# EAGLE design svf4 (EAGLE 7.2.0)
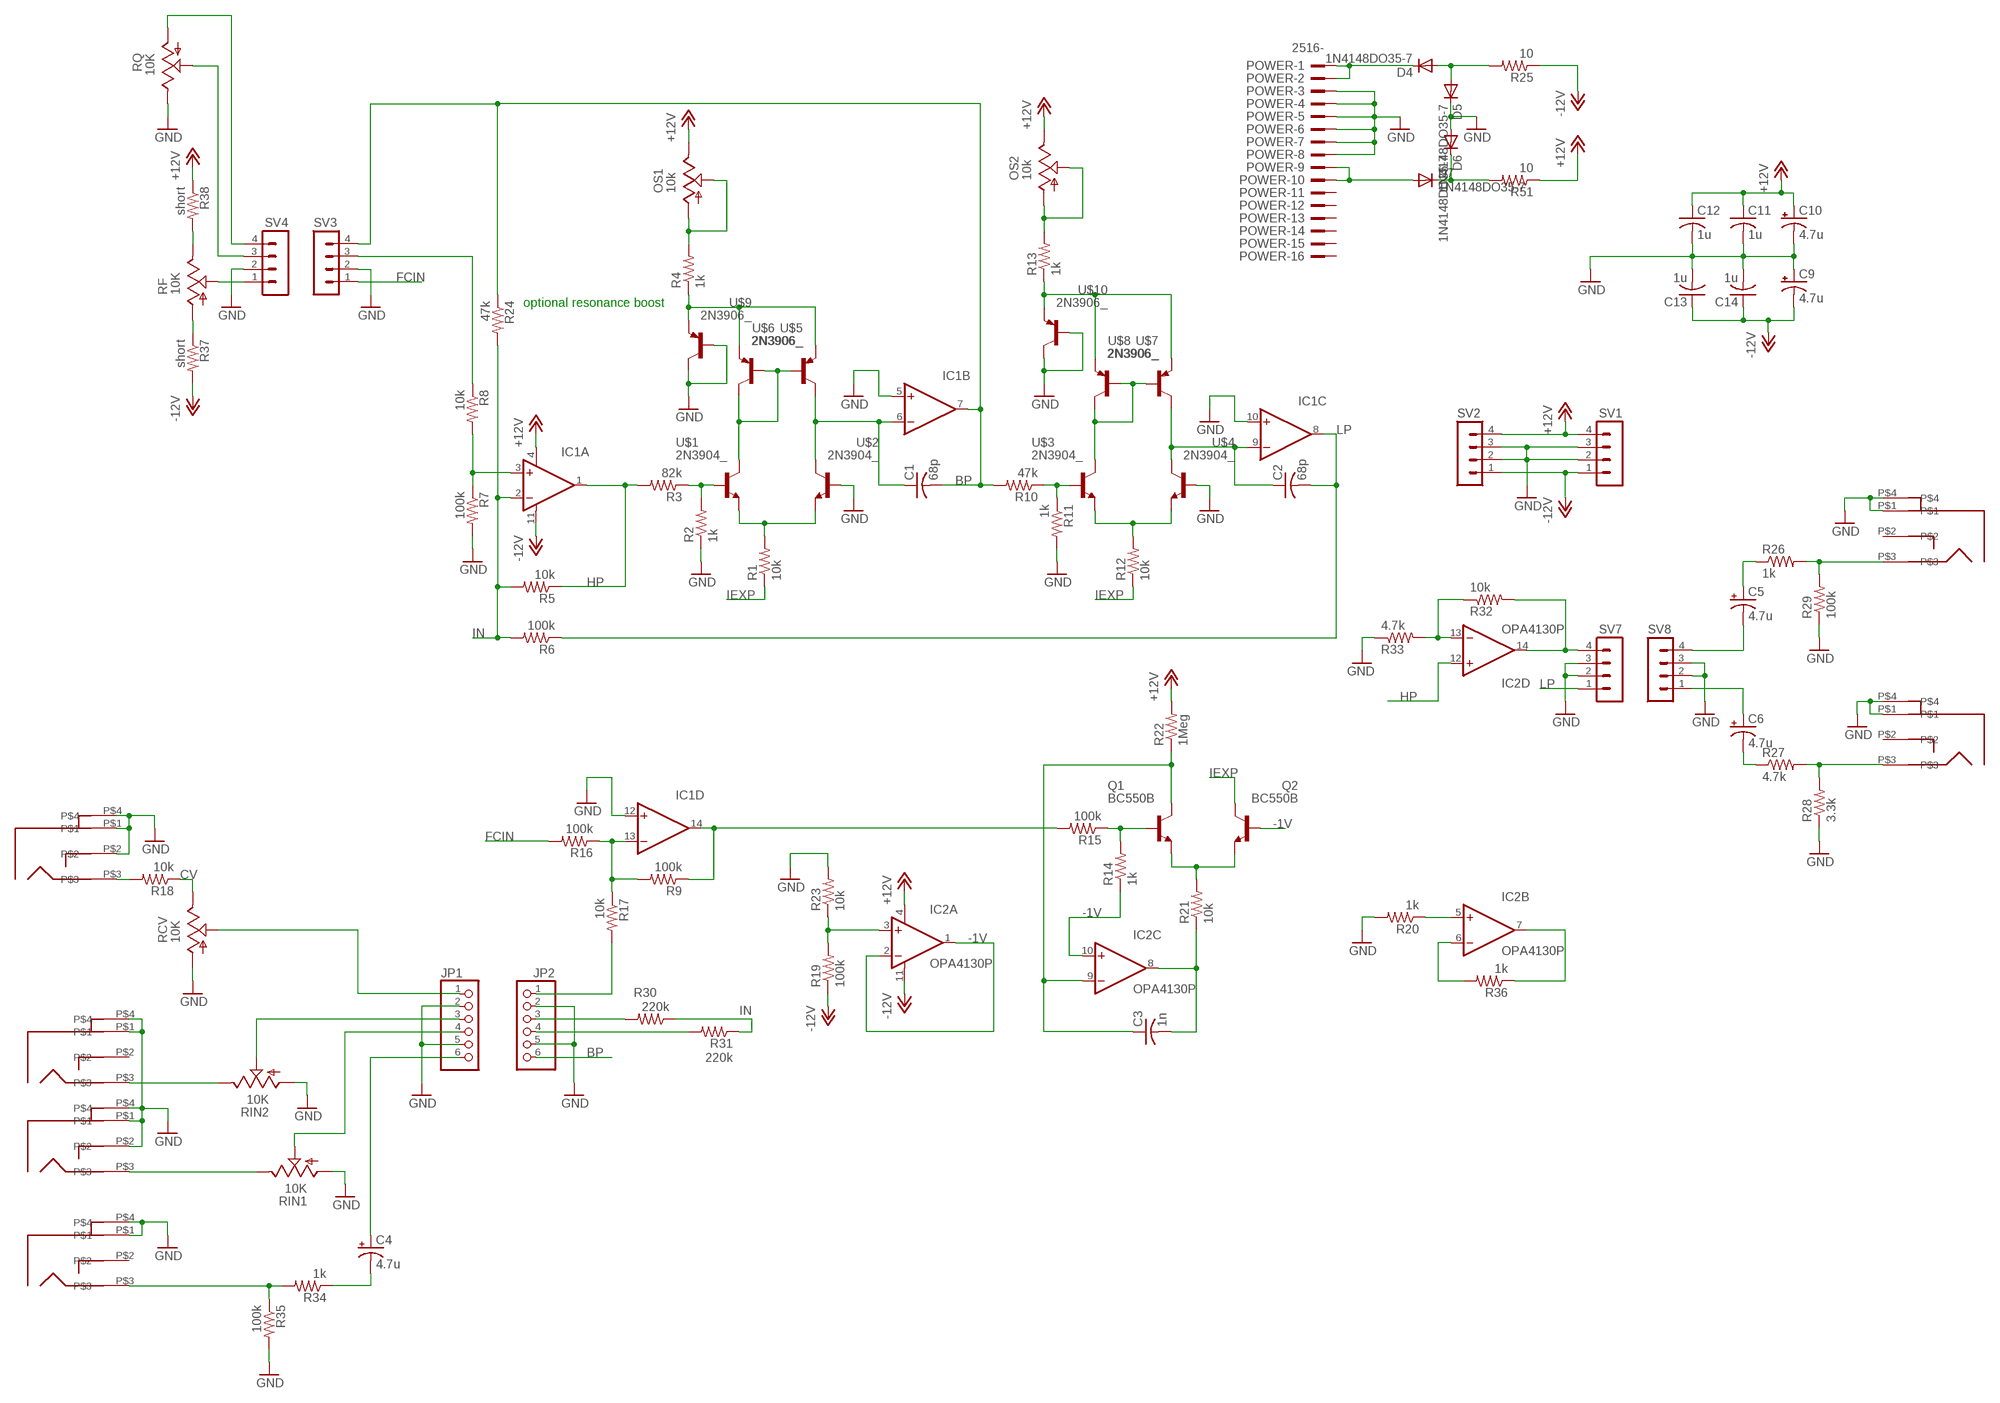
[diagram p0: schematic, sheet 1]

## Parts
BPOUT  PJ301BM  [PJ301BM]
C1  68p  C-US050-025X075  [C050-025X075]
C2  68p  C-US050-025X075  [C050-025X075]
C3  1n  C-US050-025X075  [C050-025X075]
C4  4.7u  CPOL-USE2.5-6  [E2,5-6]
C5  4.7u  CPOL-USE2.5-6  [E2,5-6]
C6  4.7u  CPOL-USE2.5-6  [E2,5-6]
C9  4.7u  CPOL-USE2.5-6  [E2,5-6]
C10  4.7u  CPOL-USE2.5-6  [E2,5-6]
C11  1u  C-US050-025X075  [C050-025X075]
C12  1u  C-US050-025X075  [C050-025X075]
C13  1u  C-US050-025X075  [C050-025X075]
C14  1u  C-US050-025X075  [C050-025X075]
CVIN  PJ301BM  [PJ301BM]
D4  1N4148DO35-7  [DO35-7]
D5  1N4148DO35-7  [DO35-7]
D6  1N4148DO35-7  [DO35-7]
D7  1N4148DO35-7  [DO35-7]
HPOUT  PJ301BM  [PJ301BM]
IC1  OPA4130P  [DIL14]
IC2  OPA4130P  [DIL14]
IN  PJ301BM  [PJ301BM]
IN1  PJ301BM  [PJ301BM]
JP1  PINHD-1X6  [1X06]
JP2  PINHD-1X6  [1X06]
LPOUT  PJ301BM  [PJ301BM]
OS1  10k  TRIM_US-S64W  [S64W]
OS2  10k  TRIM_US-S64W  [S64W]
POWER  2516-  [PAK100/2500-16]
Q1  BC550B  [TO92-EBC]
Q2  BC550B  [TO92-EBC]
R1  10k  R-US_0207/2V  [0207/2V]
R2  1k  R-US_0207/2V  [0207/2V]
R3  82k  R-US_0207/2V  [0207/2V]
R4  1k  R-US_0207/2V  [0207/2V]
R5  10k  R-US_0207/2V  [0207/2V]
R6  100k  R-US_0207/2V  [0207/2V]
R7  100k  R-US_0207/2V  [0207/2V]
R8  10k  R-US_0207/2V  [0207/2V]
R9  100k  R-US_0207/2V  [0207/2V]
R10  47k  R-US_0207/2V  [0207/2V]
R11  1k  R-US_0207/2V  [0207/2V]
R12  10k  R-US_0207/2V  [0207/2V]
R13  1k  R-US_0207/2V  [0207/2V]
R14  1k  R-US_0207/2V  [0207/2V]
R15  100k  R-US_0207/2V  [0207/2V]
R16  100k  R-US_0207/2V  [0207/2V]
R17  10k  R-US_0207/2V  [0207/2V]
R18  10k  R-US_0204/7  [0204/7]
R19  100k  R-US_0207/2V  [0207/2V]
R20  1k  R-US_0207/2V  [0207/2V]
R21  10k  R-US_0207/2V  [0207/2V]
R22  1Meg  R-US_0207/2V  [0207/2V]
R23  10k  R-US_0207/2V  [0207/2V]
R24  47k  R-US_0207/2V  [0207/2V]
R25  10  R-US_0207/2V  [0207/2V]
R26  1k  R-US_0204/7  [0204/7]
R27  4.7k  R-US_0204/7  [0204/7]
R28  3.3k  R-US_0204/7  [0204/7]
R29  100k  R-US_0204/7  [0204/7]
R30  220k  R-US_0207/2V  [0207/2V]
R31  220k  R-US_0207/2V  [0207/2V]
R32  10k  R-US_0207/2V  [0207/2V]
R33  4.7k  R-US_0207/2V  [0207/2V]
R34  1k  R-US_0204/7  [0204/7]
R35  100k  R-US_0204/7  [0204/7]
R36  1k  R-US_0207/2V  [0207/2V]
R37  short  R-US_0204/7  [0204/7]
R38  short  R-US_0204/7  [0204/7]
R51  10  R-US_0207/2V  [0207/2V]
RCV  10K  US-EVUF3J  [EVUFXJ]
RF  10K  US-EVUF3J  [EVUFXJ]
RIN1  10K  US-EVUF3J  [EVUFXJ]
RIN2  10K  US-EVUF3J  [EVUFXJ]
RQ  10K  US-EVUF3J  [EVUFXJ]
SV1  MA04-1  [MA04-1]
SV2  MA04-1  [MA04-1]
SV3  MA04-1  [MA04-1]
SV4  MA04-1  [MA04-1]
SV7  MA04-1  [MA04-1]
SV8  MA04-1  [MA04-1]
U$1  2N3904_  [TO92-EBC]
U$2  2N3904_  [TO92-EBC]
U$3  2N3904_  [TO92-EBC]
U$4  2N3904_  [TO92-EBC]
U$5  2N3906_  [TO92-EBC]
U$6  2N3906_  [TO92-EBC]
U$7  2N3906_  [TO92-EBC]
U$8  2N3906_  [TO92-EBC]
U$9  2N3906_  [TO92-EBC]
U$10  2N3906_  [TO92-EBC]

## Nets
+12V: C10.+ C11.1 C12.1 IC1.4(A:V+) IC2.4(A:V+) OS1.E OS2.E R22.2 R38.1 R51.1 SV1.4 SV2.4
-1V: IC2.1(A:OUT) IC2.2(A:-IN) IC2.10(C:+IN) Q2.B R14.1
-12V: C9.- C13.1 C14.1 IC1.11(A:V-) IC2.11(A:V-) R19.1 R25.1 R37.2 SV1.1 SV2.1
BP: C1.2 IC1.7(B:OUT) JP2.6 R10.2 R24.1 SV3.4
CV: R18.1 RCV.3(E)
FCIN: R16.2 SV3.1
GND: BPOUT.P$1 BPOUT.P$4 C9.+ C10.- C11.2 C12.2 C13.2 C14.2 CVIN.P$1 CVIN.P$2 CVIN.P$4 D5.C D6.A HPOUT.P$1 HPOUT.P$4 IC1.5(B:+IN) IC1.10(C:+IN) IC1.12(D:+IN) IN1.P$1 IN1.P$4 IN.P$1 IN.P$2 IN.P$4 JP1.2 JP1.5 JP2.2 JP2.5 LPOUT.P$1 LPOUT.P$4 POWER.3 POWER.4 POWER.5 POWER.6 POWER.7 POWER.8 R2.1 R7.2 R11.2 R20.2 R23.2 R28.1 R29.1 R33.1 R35.2 RCV.1(A) RIN1.1(A) RIN2.1(A) RQ.3(E) SV1.2 SV1.3 SV2.2 SV2.3 SV3.2 SV4.2 SV7.2 SV7.3 SV8.2 SV8.3 U$2.B U$4.B U$9.B U$9.E(C) U$10.B U$10.E(C)
HP: IC1.1(A:OUT) IC2.12(D:+IN) R3.2 R5.1
IEXP: Q2.C R1.1 R12.1
IN: IC1.2(A:-IN) R5.2 R6.2 R24.2 R30.1 R31.1
LP: C2.2 IC1.8(C:OUT) R6.1 SV7.1
LPOUT: LPOUT.P$3 R27.2 R28.2
N$1: R12.2 U$3.C(E) U$4.C(E)
N$2: OS1.A OS1.S R4.2
N$3: R4.1 U$5.C(E) U$6.C(E) U$9.C(E)
N$4: U$1.E(C) U$5.B U$5.E(C) U$6.B
N$5: R1.2 U$1.C(E) U$2.C(E)
N$6: R2.2 R3.1 U$1.B
N$7: IC2.7(B:OUT) R36.1
N$8: C6.+ SV8.1
N$9: IC1.3(A:+IN) R7.1 R8.2
N$10: OS2.A OS2.S R13.2
N$11: C1.1 IC1.6(B:-IN) U$2.E(C) U$6.E(C)
N$12: R8.1 SV3.3
N$13: IC1.13(D:-IN) R9.2 R16.1 R17.1
N$14: U$3.E(C) U$7.B U$7.E(C) U$8.B
N$15: R10.1 R11.1 U$3.B
N$16: JP2.1 R17.2
N$17: R13.1 U$7.C(E) U$8.C(E) U$10.C(E)
N$18: C2.1 IC1.9(C:-IN) U$4.E(C) U$8.E(C)
N$19: RF.2(S) SV4.1
N$20: D4.A D5.A R25.2
N$21: Q1.B R14.2 R15.1
N$22: IC1.14(D:OUT) R9.1 R15.2
N$23: CVIN.P$3 R18.2
N$24: Q1.E Q2.E R21.2
N$25: RQ.1(A) SV4.4
N$26: C3.2 IC2.8(C:OUT) R21.1
N$27: D6.C D7.C R51.2
N$28: C3.1 IC2.9(C:-IN) Q1.C R22.1
N$29: IC2.3(A:+IN) R19.2 R23.1
N$30: JP1.1 RCV.2(S)
N$31: RQ.2(S) SV4.3
N$32: C5.- SV8.4
N$33: JP1.4 RIN1.2(S)
N$34: IN.P$3 RIN1.3(E)
N$35: HPOUT.P$3 R26.2 R29.2
N$36: C4.+ JP1.6
N$37: JP2.3 R30.2
N$38: BPOUT.P$3 R34.2 R35.1
N$39: IN1.P$3 RIN2.3(E)
N$40: JP1.3 RIN2.2(S)
N$41: IC2.14(D:OUT) R32.2 SV7.4
N$42: IC2.13(D:-IN) R32.1 R33.2
N$43: C6.- R27.1
N$44: C5.+ R26.1
N$45: C4.- R34.1
N$46: JP2.4 R31.2
N$47: IC2.5(B:+IN) R20.1
N$48: IC2.6(B:-IN) R36.2
N$49: R38.2 RF.3(E)
N$50: R37.1 RF.1(A)
N$71: D7.A POWER.9 POWER.10
N$72: D4.C POWER.1 POWER.2
Unconnected: BPOUT.P$2 HPOUT.P$2 IN1.P$2 LPOUT.P$2 POWER.11 POWER.12 POWER.13 POWER.14 POWER.15 POWER.16

## Notes on the sheet
- optional resonance boost

## Library data of the parts
BPOUT CVIN HPOUT IN IN1 LPOUT = dan:PJ301BM
C1-C3 C11-C14 = dan:C-US: CAPACITOR, American symbol
C4-C6 C9 C10 = dan:CPOL-US: POLARIZED CAPACITOR, American symbol
D4-D7 = dan:1N4148: DIODE high speed (Philips)
IC1 IC2 = dan:OPA4130: Low Power, Precision FET-Input Operational Amplifiers; OC_FARNELL: unknown; OC_NEWARK: unknown
JP1 JP2 = dan:PINHD-1X6: PIN HEADER
OS1 OS2 = dan:TRIM_US-: POTENTIOMETER
POWER = dan:2516-: 3M (TM) Pak 100 4-Wall Header Source: 3M; OC_FARNELL: unknown; OC_NEWARK: unknown
Q1 Q2 = dan:BC550*: NPN Transistor
R1-R38 R51 = dan:R-US_: RESISTOR, American symbol
RCV RF RIN1 RIN2 RQ = dan:US-EVU: 9 mm Square Rotary Potentiometers Source: Panasonic
SV1-SV4 SV7 SV8 = dan:MA04-1: PIN HEADER; OC_FARNELL: unknown; OC_NEWARK: unknown
U$1-U$4 = dan:2N3904_
U$5-U$10 = dan:2N3906_

## Board
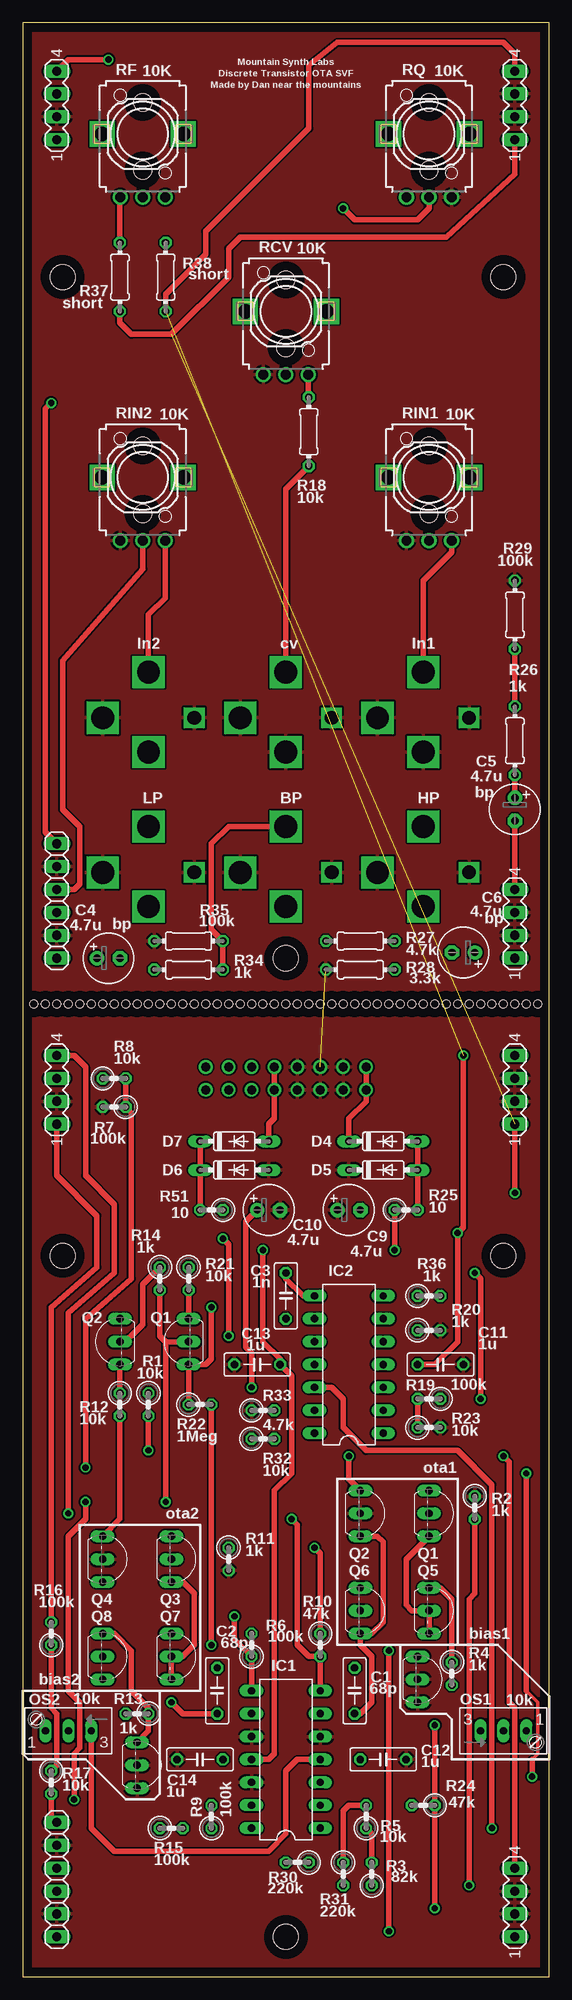
[diagram p1: board, top side]
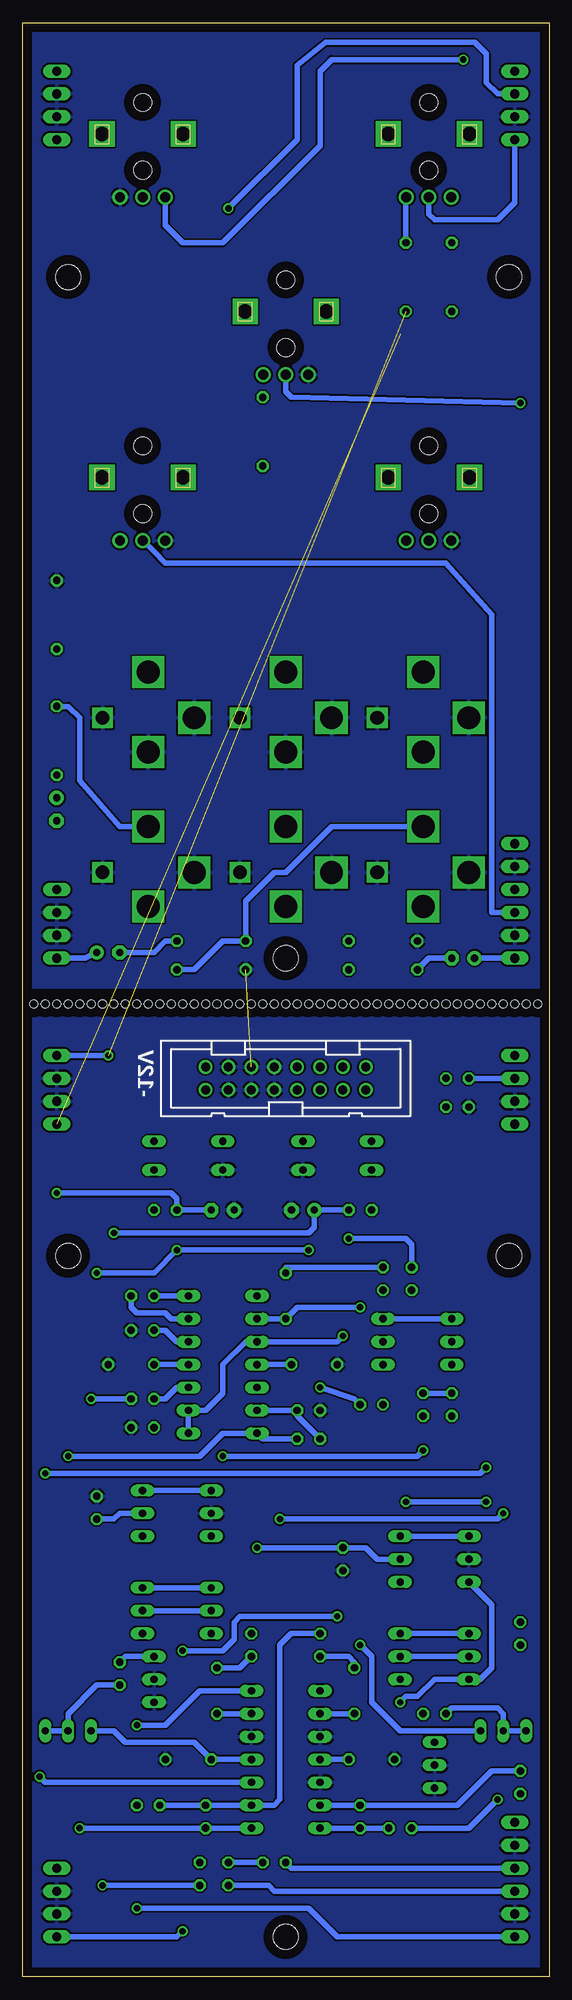
[diagram p2: board, bottom side, seen from below]

Size 58.4 x 216.84 mm. Coordinates in mm from the lower left corner, seen from the top.
Outline: 0,0 58.4,0 58.4,216.84 0,216.84 0,0
Copper layers (1*16): Top 0.035mm / dielectric 1.5mm / Bottom 0.035mm
Design rules "default": minimum track width 10mil, minimum drill 24mil, track to track 8mil, track to pad 8mil, pad to pad 8mil, via to via 8mil, smd to smd 8mil, copper to edge 40mil, drill to drill 8mil, minimum pad ring 10mil, minimum via ring 8mil, stop-mask expansion 4mil, vias tented up to drill 0mil, thermal gap 10mil
Holes 0.9 mm at 1.27,107.95 2.54,107.95 3.81,107.95 5.08,107.95 6.35,107.95 7.62,107.95 8.89,107.95 10.16,107.95 11.43,107.95 12.7,107.95 13.97,107.95 15.24,107.95 16.51,107.95 17.78,107.95 19.05,107.95 20.32,107.95 21.59,107.95 22.86,107.95 24.13,107.95 25.4,107.95 26.67,107.95 27.94,107.95 29.21,107.95 30.48,107.95 31.75,107.95 33.02,107.95 34.29,107.95 35.56,107.95 36.83,107.95 38.1,107.95 39.37,107.95 40.64,107.95 41.91,107.95 43.18,107.95 44.45,107.95 45.72,107.95 46.99,107.95 48.26,107.95 49.53,107.95 50.8,107.95 52.07,107.95 53.34,107.95 54.61,107.95 55.88,107.95 57.15,107.95
Holes 2.8 mm at 29.21,4.45 53.34,80.01 4.45,80.01 29.21,113.03 4.45,188.59 53.34,188.59

### Footprints (pad centres in the part's own frame; a part is rotated, then mirrored left to right if it is on the bottom)
PJ301BM = drill 1.524 square: P$1 5.08,0 | drill 2.54 square: P$2 0,-3.81; P$3 0,5.08; P$4 -5.08,0
C050-025X075 = drill 0.813 octagon: 1 -2.54,0; 2 2.54,0
E2,5-6 = drill 0.813 pad 1.6: + -1.27,0 | drill 0.813 pad 1.6 octagon: - 1.27,0
DO35-7 = drill 0.813 long: A 3.81,0; C -3.81,0
DIL14 = drill 0.813 long: 1 -7.62,-3.81; 2 -5.08,-3.81; 3 -2.54,-3.81; 4 0,-3.81; 5 2.54,-3.81; 6 5.08,-3.81; 7 7.62,-3.81; 8 7.62,3.81; 9 5.08,3.81; 10 2.54,3.81; 11 0,3.81; 12 -2.54,3.81; 13 -5.08,3.81; 14 -7.62,3.81
1X06 = drill 1.016 long: 1 -6.35,0; 2 -3.81,0; 3 -1.27,0; 4 1.27,0; 5 3.81,0; 6 6.35,0
S64W = drill 0.813 long: A 2.54,1.27; E -2.54,1.27; S 0,1.27
PAK100/2500-16 = drill 1 pad 1.422: 1 -8.89,-1.27; 2 -8.89,1.27; 3 -6.35,-1.27; 4 -6.35,1.27; 5 -3.81,-1.27; 6 -3.81,1.27; 7 -1.27,-1.27; 8 -1.27,1.27; 9 1.27,-1.27; 10 1.27,1.27; 11 3.81,-1.27; 12 3.81,1.27; 13 6.35,-1.27; 14 6.35,1.27; 15 8.89,-1.27; 16 8.89,1.27
TO92-EBC = drill 0.813 long: B 0,-1.27; C -2.54,-1.27; E 2.54,-1.27
0207/2V = drill 0.813 octagon: 1 -1.27,0; 2 1.27,0
0204/7 = drill 0.813 octagon: 1 -3.81,0; 2 3.81,0
EVUFXJ = drill 1.1 pad 1.676: 1 -2.5,-7; 2 0,-7; 3 2.5,-7 | drill 1.6 pad 2.8 square: M1 4.5,0; M2 -4.5,0 | hole 2: 0,3.5; 0,-4
MA04-1 = drill 1.016 long: 1 -3.81,0; 2 -1.27,0; 3 1.27,0; 4 3.81,0

### Placement (x,y rotation side)
BPOUT  29.21,122.56 0 top
C1  36.83,31.75 90 top
C2  21.59,31.75 90 top
C3  29.21,75.56 90 top
C4  9.53,113.03 0 top
C5  54.61,129.54 270 top
C6  48.9,113.67 180 top
C9  36.2,85.09 0 top
C10  27.3,85.09 0 top
C11  46.35,67.94 0 top
C12  40.01,24.13 0 top
C13  26.04,67.94 180 top
C14  19.68,24.13 180 top
CVIN  29.21,139.7 0 top
D4  40.01,92.71 0 top
D5  40.01,89.53 0 top
D6  23.5,89.53 0 top
D7  23.5,92.71 0 top
HPOUT  44.45,122.56 0 top
IC1  29.21,24.13 90 top
IC2  36.2,67.94 90 top
IN  44.45,139.7 0 top
IN1  13.97,139.7 0 top
JP1  3.81,119.38 270 top
JP2  3.81,10.79 270 top
LPOUT  13.97,122.56 0 top
OS1  53.34,26.04 0 top
OS2  5.08,28.57 180 top
POWER  29.21,99.69 0 bottom
Q1  17.14,70.48 90 top
Q2  9.53,70.48 90 top
R1  13.97,63.5 270 top
R2  50.16,52.07 270 top
R3  38.73,11.43 90 top
R4  47.62,33.66 270 top
R5  38.1,17.78 90 top
R6  25.4,36.83 90 top
R7  10.16,96.52 180 top
R8  10.16,99.69 0 top
R9  20.95,17.78 90 top
R10  33.02,36.83 270 top
R11  22.86,46.35 270 top
R12  10.79,63.5 270 top
R13  12.7,29.21 180 top
R14  15.24,77.47 270 top
R15  16.51,16.51 0 top
R16  3.17,38.1 90 top
R17  3.17,21.59 270 top
R18  31.75,171.45 270 top
R19  45.09,64.14 180 top
R20  45.09,71.75 0 top
R21  18.41,77.47 270 top
R22  19.68,63.5 0 top
R23  45.09,60.96 0 top
R24  44.45,19.05 180 top
R25  42.55,85.09 0 top
R26  54.61,137.16 90 top
R27  37.47,114.94 180 top
R28  37.47,111.76 0 top
R29  54.61,151.13 270 top
R30  30.48,12.7 180 top
R31  35.56,11.43 270 top
R32  26.67,59.69 0 top
R33  26.67,62.87 0 top
R34  18.41,111.76 0 top
R35  18.41,114.94 180 top
R36  45.09,75.56 0 top
R37  10.79,188.59 270 top
R38  15.88,188.59 90 top
R51  20.95,85.09 180 top
RCV  29.21,184.78 0 top
RF  13.34,204.47 0 top
RIN1  45.09,166.37 0 top
RIN2  13.34,166.37 0 top
RQ  45.09,204.47 0 top
SV1  54.61,98.42 90 top
SV2  54.61,207.65 90 top
SV3  3.81,98.42 90 top
SV4  3.81,207.65 90 top
SV7  54.61,8.26 90 top
SV8  54.61,116.84 90 top
U$1  46.35,51.44 270 top
U$2  38.73,51.44 270 top
U$3  17.78,46.35 270 top
U$4  10.16,46.35 270 top
U$5  46.35,40.64 270 top
U$6  38.73,40.64 270 top
U$7  17.78,35.56 270 top
U$8  10.16,35.56 270 top
U$9  45.09,33.02 270 top
U$10  13.97,23.5 270 top

### Tracks (layer width: path | path; a pad name or v marks a point on that pad's centre or on a via)
+12V  (via drill 0.7)  (1 unrouted)
  Top 0.61: v48.9,102.23 48.9,83.19 v48.26,82.55 48.26,70.48 45.72,67.94 C11.1 | v25.4,65.41 25.4,69.22 24.77,69.85 24.77,83.82 C10.+ | R22.2 v20.95,36.83 | OS2.E 7.62,16.51 10.16,13.97 27.3,13.97 29.21,15.88 29.21,22.86 30.48,24.13 IC1.4 | SV2.4 54.61,213.36 53.34,214.63 34.92,214.63 31.75,212.09 31.75,205.1 20.32,193.68 20.32,191.13 15.88,186.69 R38.1
  Bottom 0.61: R51.1 C10.+ 26.04,83.19 26.67,82.55 v48.26,82.55 | SV1.4 v48.9,102.23 | R22.2 21.59,64.14 v25.4,65.41 | IC2.4 C11.1 | IC1.4 C12.1 39.37,26.04 46.99,26.04 48.26,27.3 OS1.E | v20.95,36.83 19.68,35.56 19.68,30.48 16.51,27.3 OS2.E
-1V  (via drill 0.7)
  Top 0.61: v22.86,71.12 22.86,81.28 v22.23,81.92 | Q2.B 12.06,71.12 13.34,72.39 13.34,76.83 R14.1
  Bottom 0.61: v22.86,71.12 23.5,70.48 IC2.10 33.66,70.48 36.2,67.94 36.2,64.77 38.1,62.87 IC2.2 IC2.1 | v22.23,81.92 15.88,81.92 15.24,81.28 R14.1
-12V  (via drill 0.7)  (1 unrouted)
  Top 0.61: SV1.1 v54.61,87 | v50.8,64.14 50.8,77.47 v50.16,78.11 | v41.27,80.64 R25.1 | v26.67,80.64 26.67,70.48 28.57,68.58 C13.1 29.84,66.67 29.84,55.88 27.94,53.98 27.94,24.77 27.3,24.13 IC1.11 | SV2.1 54.61,200.03 46.99,193.04 24.13,193.04 22.86,191.77 22.86,188.59 16.51,182.25 12.06,182.25 10.79,183.51 R37.2
  Bottom 0.61: C9.- R25.1 41.27,86.36 41.91,87 v54.61,87 | C13.1 IC2.11 | R19.1 v50.8,64.14 | v50.16,78.11 43.81,78.11 v41.27,80.64 v26.67,80.64 | C14.1 IC1.11
BP  (via drill 0.7)
  Top 0.61: IC1.7 R10.2 31.75,35.56 30.48,36.83 30.48,50.16 v29.84,50.8 | v45.72,27.94 R24.1 v45.72,7.62 | SV3.4 5.71,102.23 6.99,100.97 6.99,88.9 10.16,85.72 10.16,78.11 5.08,73.66 v5.08,51.44
  Bottom 0.61: C1.2 34.29,34.29 R10.2 | JP2.6 23.5,4.45 26.67,7.62 v45.72,7.62 | v29.84,50.8 5.71,50.8 v5.08,51.44 | IC1.7 38.73,31.75 42.55,27.94 v45.72,27.94
CV
  Top 0.61: RCV.3 31.71,175.94 R18.1
FCIN
  Top 0.61: R16.2 3.17,74.3 8.26,78.74 8.26,84.45 3.81,88.9 SV3.1
GND  (1 unrouted)
  pour Top: 59.69,-1.27 59.69,217.81 -1.27,217.81 -1.27,-1.27
  pour Bottom: -0.64,106.68 59.05,106.68 59.05,-0.64 -0.64,-0.64
  pour Bottom: -0.64,109.86 59.05,109.86 59.05,217.17 -0.64,217.17
HP  (via drill 0.7)
  Top 0.61: R3.2 38.73,15.88 R5.1 | v52.07,16.51 52.07,54.61 48.26,58.42 38.1,58.42 35.56,60.96 35.56,64.14 34.29,65.41 IC2.12
  Bottom 0.61: IC1.1 R5.1 v52.07,16.51
IEXP
  Top 0.61: Q2.C R12.1
  Bottom 0.61: R1.1 R12.1
IN
  Top 0.61: R31.1 35.56,18.41 36.2,19.05 R5.2
  Bottom 0.61: R31.1 R30.1 | R24.2 R5.2 IC1.2 30.48,19.05 29.84,19.68 29.84,36.83 28.57,38.1 R6.2
LP  (via drill 0.7)
  Top 0.61: IC1.8 R6.1 23.5,37.47 v23.5,40.01 | v40.64,5.08 v40.64,36.2
  Bottom 0.61: C2.2 21.59,34.92 22.23,35.56 R6.1 | SV7.1 41.27,4.45 v40.64,5.08 | v40.64,36.2 36.2,36.2 34.92,37.47 34.92,39.37 34.29,40.01 v23.5,40.01
LPOUT
  Bottom 0.61: R28.2 39.37,111.76 36.2,114.94 R27.2 33.66,119.38 30.48,122.56 29.21,122.56 24.13,127.64 LPOUT.P$3
N$1
  Top 0.61: R12.2 10.79,50.8 U$4.C
  Bottom 0.61: U$4.C U$3.C
N$2
  Bottom 0.61: OS1.A OS1.S 53.34,29.21 50.16,32.38 R4.2
N$3
  Top 0.61: R4.1 47.62,41.91 46.35,43.18 U$5.C
  Bottom 0.61: U$6.C U$5.C | U$9.C 46.99,35.56 R4.1
N$4
  Top 0.61: U$5.E U$5.B 43.18,40.64 42.55,41.27 42.55,46.35 U$1.E
  Bottom 0.61: U$6.B U$5.B
N$5  (via drill 0.7)
  Top 0.61: v13.97,58.42 R1.2 | v36.2,57.78 36.2,55.24 U$2.C
  Bottom 0.61: v36.2,57.78 14.61,57.78 v13.97,58.42 | U$2.C U$1.C
N$6  (via drill 0.7)
  Top 0.61: v49.53,10.16 49.53,41.91 50.16,42.55 R2.2
  Bottom 0.61: R3.1 v49.53,10.16 | U$1.B 47.62,51.44 48.26,50.8 R2.2
N$7
  Bottom 0.61: R36.1 IC2.7
N$8
  Bottom 0.61: C6.+ 51.44,113.03 SV8.1
N$9  (via drill 0.7)
  Top 0.406: 56.52,24.13 57.15,24.77 57.15,30.48 55.88,31.75
  Top 0.61: R8.2 R7.1 12.06,95.89 12.06,77.47 6.99,73.03 v6.99,56.52 | v56.52,22.23 56.52,24.13 | 55.88,31.75 v55.88,55.88
  Bottom 0.61: IC1.3 55.88,21.59 v56.52,22.23 | v55.88,55.88 7.62,55.88 v6.99,56.52
N$10
  Bottom 0.61: OS2.A OS2.S 5.08,29.21 5.71,29.84 10.79,29.84 R13.2
N$11
  Top 0.61: U$2.E 39.37,48.9 40.01,48.26 40.01,39.37 38.73,38.1 U$6.E 37.47,36.83 38.73,35.56 38.73,30.48 37.47,29.21 C1.1
  Bottom 0.61: IC1.6 C1.1
N$12
  Bottom 0.61: R8.1 SV3.3
N$13
  Top 0.61: R16.1 3.17,29.84 3.81,29.21 3.81,23.5 R17.1
  Bottom 0.61: IC1.13 R9.2 10.16,19.05 6.35,22.86 R17.1
N$14
  Top 0.61: U$7.E U$7.B 17.78,35.56 19.05,36.83 19.05,42.55 17.78,43.81 U$3.E
  Bottom 0.61: U$7.B U$8.B
N$15  (via drill 0.7)
  Top 0.61: R10.1 33.02,46.99 v32.38,47.62
  Bottom 0.61: v32.38,47.62 R11.1 20.32,47.62 19.05,46.35 U$3.B
N$16
  Top 0.61: R17.2 3.17,17.78 JP2.1
N$17
  Top 0.61: U$8.C 10.16,38.1 12.06,36.2 12.06,31.75 13.97,29.84 R13.1 13.97,27.3 U$10.C
  Bottom 0.61: U$7.C U$8.C
N$18  (via drill 0.7)
  Top 0.61: v16.51,30.48 17.78,29.21 C2.1
  Bottom 0.61: IC1.9 C2.1 | v16.51,30.48 15.88,31.11 14.61,31.11 12.7,33.02 U$8.E 7.62,33.02 6.35,34.29 6.35,41.27 U$4.E
N$19
  Bottom 0.61: RF.2 13.34,195.58 12.7,194.94 5.71,194.94 3.81,196.85 SV4.1
N$20
  Top 0.61: D4.A D5.A R25.2
N$21  (via drill 0.7)
  Top 0.61: R14.2 15.24,71.12 15.88,70.48 | 15.88,70.48 Q1.B | v6.99,52.7 6.99,50.8 5.08,48.9 5.08,31.75 6.35,30.48 6.35,25.4 5.71,24.77 v5.71,19.68 | v15.88,52.7 15.88,70.48
  Bottom 0.61: R15.1 8.89,16.51 v5.71,19.68 | v6.99,52.7 v15.88,52.7
N$22
  Bottom 0.61: IC1.14 R9.1 R15.2
N$23
  Top 0.61: R18.2 29.21,165.1 CVIN.P$3
N$24
  Top 0.61: Q1.E R21.2
  Bottom 0.61: Q2.E Q1.E
N$25  (via drill 0.7)
  Top 0.61: v9.53,212.72 5.08,212.72 SV4.4
  Bottom 0.61: v9.53,212.72 24.13,212.72 25.4,211.46 25.4,203.2 36.2,192.41 40.64,192.41 42.59,194.35 RQ.1
N$26
  Top 0.61: IC2.8 31.11,75.56 29.21,77.47 C3.2
  Bottom 0.61: R21.1 29.21,78.74 C3.2
N$27
  Top 0.61: D7.C D6.C R51.2
N$28  (via drill 0.7)
  Top 0.61: R22.1 Q1.C 20.32,67.94 20.95,68.58 v20.95,74.3
  Bottom 0.61: IC2.9 C3.1 27.94,74.3 v20.95,74.3
N$29
  Top 0.61: R23.1 R19.2
  Bottom 0.61: IC2.3 41.27,65.41 42.55,64.14 R19.2
N$30  (via drill 0.7)
  Top 0.61: v3.17,174.62 2.54,173.99 2.54,127 JP1.1
  Bottom 0.61: v3.17,174.62 28.57,175.26 29.21,175.9 RCV.2
N$31  (via drill 0.7)
  Top 0.61: v35.56,196.22 36.83,194.94 43.81,194.94 45.09,196.22 RQ.2
  Bottom 0.61: SV4.3 5.71,208.91 6.99,210.19 6.99,213.36 8.26,214.63 24.77,214.63 27.94,212.09 27.94,203.84 v35.56,196.22
N$32
  Top 0.61: SV8.4 C5.-
N$33
  Bottom 0.61: RIN1.2 43.81,158.12 42.55,156.84 11.43,156.84 6.35,151.13 6.35,118.11 JP1.4
N$34
  Top 0.61: RIN1.3 47.59,158.07 44.45,154.94 IN.P$3
N$35
  Top 0.61: R29.2 R26.2
  Bottom 0.61: R26.2 53.34,140.97 52.07,139.7 52.07,132.72 47.62,127.64 HPOUT.P$3
N$36
  Bottom 0.61: JP1.6 C4.+
N$37
  Bottom 0.61: JP2.3 28.57,12.06 R30.2
N$38
  Top 0.61: R34.2 R35.1 20.95,116.2 20.95,125.73 22.86,127.64 BPOUT.P$3
N$39
  Top 0.61: RIN2.3 15.84,153 13.97,151.13 IN1.P$3
N$40
  Top 0.61: RIN2.2 13.34,156.21 4.45,146.05 4.45,129.54 6.35,127.64 6.35,121.28 5.71,120.65 JP1.3
N$41  (via drill 0.7)
  Top 0.61: v53.34,57.78 53.98,57.15 53.98,30.48 54.61,29.84 SV7.4
  Bottom 0.61: R32.2 31.75,59.69 IC2.14 36.2,60.33 38.73,57.78 v53.34,57.78
N$42
  Bottom 0.61: IC2.13 R33.2 27.94,62.23 R32.1
N$43
  Bottom 0.61: C6.- 43.81,113.67 42.55,114.94 R27.1
N$44
  Top 0.61: C5.+ R26.1
N$45
  Bottom 0.61: R34.1 13.34,113.03 C4.-
N$46
  Bottom 0.61: R31.2 31.11,10.16 30.48,9.53 JP2.4
N$47
  Bottom 0.61: IC2.5 41.27,70.48 42.55,71.75 R20.1
N$48
  Bottom 0.61: IC2.6 41.91,73.03 42.55,73.66 45.72,73.66 46.35,74.3 R36.2
N$49
  Bottom 0.61: R38.2 15.88,197.43 RF.3
N$50
  Top 0.61: R37.1 10.79,197.43 RF.1
N$71
  Top 0.61: POWER.10 POWER.9 27.94,95.25 27.3,94.61 D7.A
N$72
  Top 0.61: POWER.2 POWER.1 38.1,97.16 36.2,95.25 D4.C

### Text on the board
tPlace: Mountain Synth Labs | Discrete Transistor OTA SVF | Made by Dan near the mountains | In2 | cv | In1 | bp | LP | BP | HP | bp | bp | ota1 | ota2 | Q2 | Q1 | Q6 | Q5 | Q4 | Q3 | Q8 | Q7 | bias1 | bias2
bPlace: -12V